# Altium project PowerSupply_v2-5.PrjPcb
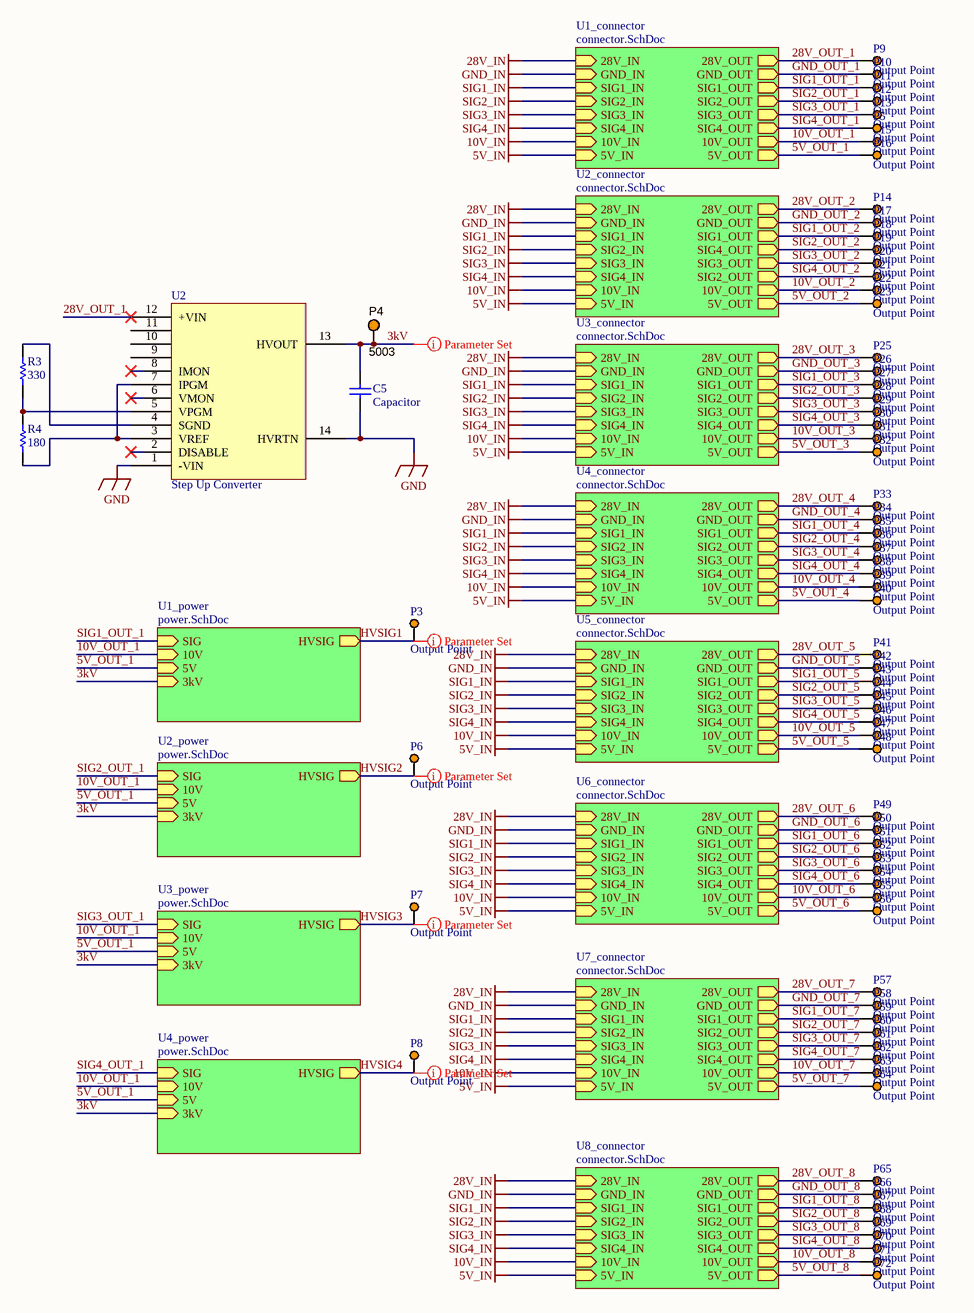
[diagram p0: top.SchDoc]
3 sheets, 121 parts. Net scope: hierarchical (ports join the sheet entries above them; power ports are global).
Board file: board.PcbDoc
Sheets:
  top.SchDoc
    U1_power = power.SchDoc
    U2_power = power.SchDoc
    U3_power = power.SchDoc
    U4_power = power.SchDoc
    U5_connector = connector.SchDoc
    U6_connector = connector.SchDoc
    U7_connector = connector.SchDoc
    U8_connector = connector.SchDoc
    U1_connector = connector.SchDoc
    U2_connector = connector.SchDoc
    U3_connector = connector.SchDoc
    U4_connector = connector.SchDoc

## Sheet top.SchDoc
size C; SheetNumber: 1; SheetTotal: 3

### Parts
C5  Capacitor  [HV Capacitor]
P3  Output Point  [Via]
P4  5003  [KSTN-5003]
P5  Output Point  [Via]
P6  Output Point  [Via]
P7  Output Point  [Via]
P8  Output Point  [Via]
P9  Output Point  [Via]
P10  Output Point  [Via]
P11  Output Point  [Via]
P12  Output Point  [Via]
P13  Output Point  [Via]
P14  Output Point  [Via]
P15  Output Point  [Via]
P16  Output Point  [Via]
P17  Output Point  [Via]
P18  Output Point  [Via]
P19  Output Point  [Via]
P20  Output Point  [Via]
P21  Output Point  [Via]
P22  Output Point  [Via]
P23  Output Point  [Via]
P25  Output Point  [Via]
P26  Output Point  [Via]
P27  Output Point  [Via]
P28  Output Point  [Via]
P29  Output Point  [Via]
P30  Output Point  [Via]
P31  Output Point  [Via]
P32  Output Point  [Via]
P33  Output Point  [Via]
P34  Output Point  [Via]
P35  Output Point  [Via]
P36  Output Point  [Via]
P37  Output Point  [Via]
P38  Output Point  [Via]
P39  Output Point  [Via]
P40  Output Point  [Via]
P41  Output Point  [Via]
P42  Output Point  [Via]
P43  Output Point  [Via]
P44  Output Point  [Via]
P45  Output Point  [Via]
P46  Output Point  [Via]
P47  Output Point  [Via]
P48  Output Point  [Via]
P49  Output Point  [Via]
P50  Output Point  [Via]
P51  Output Point  [Via]
P52  Output Point  [Via]
P53  Output Point  [Via]
P54  Output Point  [Via]
P55  Output Point  [Via]
P56  Output Point  [Via]
P57  Output Point  [Via]
P58  Output Point  [Via]
P59  Output Point  [Via]
P60  Output Point  [Via]
P61  Output Point  [Via]
P62  Output Point  [Via]
P63  Output Point  [Via]
P64  Output Point  [Via]
P65  Output Point  [Via]
P66  Output Point  [Via]
P67  Output Point  [Via]
P68  Output Point  [Via]
P69  Output Point  [Via]
P70  Output Point  [Via]
P71  Output Point  [Via]
P72  Output Point  [Via]
R3  330  [4.99 Ohm]
R4  180  [4.99 Ohm]
U2  Step Up Converter  [Step Up Converter]

### Sub-sheets
U1_connector = connector.SchDoc: 28V_IN (in), GND_IN (in), SIG1_IN (in), SIG2_IN (in), SIG3_IN (in), SIG4_IN (in), 10V_IN (in), 5V_IN (in), 28V_OUT (out), GND_OUT (out), SIG1_OUT (out), SIG2_OUT (out), SIG3_OUT (out), SIG4_OUT (out), 10V_OUT (out), 5V_OUT (out)
U1_power = power.SchDoc: SIG (in), 10V (in), 5V (in), HVSIG (out), 3kV (in)
U2_connector = connector.SchDoc: 28V_IN (in), GND_IN (in), SIG1_IN (in), SIG2_IN (in), SIG3_IN (in), SIG4_IN (in), 10V_IN (in), 5V_IN (in), 28V_OUT (out), GND_OUT (out), SIG1_OUT (out), SIG4_OUT (out), SIG3_OUT (out), SIG2_OUT (out), 10V_OUT (out), 5V_OUT (out)
U2_power = power.SchDoc: SIG (in), 10V (in), 5V (in), HVSIG (out), 3kV (in)
U3_connector = connector.SchDoc: 28V_IN (in), GND_IN (in), SIG1_IN (in), SIG2_IN (in), SIG3_IN (in), SIG4_IN (in), 10V_IN (in), 5V_IN (in), 28V_OUT (out), GND_OUT (out), SIG1_OUT (out), SIG2_OUT (out), SIG3_OUT (out), SIG4_OUT (out), 10V_OUT (out), 5V_OUT (out)
U3_power = power.SchDoc: SIG (in), 10V (in), 5V (in), HVSIG (out), 3kV (in)
U4_connector = connector.SchDoc: 28V_IN (in), GND_IN (in), SIG1_IN (in), SIG2_IN (in), SIG3_IN (in), SIG4_IN (in), 10V_IN (in), 5V_IN (in), 28V_OUT (out), GND_OUT (out), SIG1_OUT (out), SIG2_OUT (out), SIG3_OUT (out), SIG4_OUT (out), 10V_OUT (out), 5V_OUT (out)
U4_power = power.SchDoc: SIG (in), 10V (in), 5V (in), HVSIG (out), 3kV (in)
U5_connector = connector.SchDoc: 28V_IN (in), GND_IN (in), SIG1_IN (in), SIG2_IN (in), SIG3_IN (in), SIG4_IN (in), 10V_IN (in), 5V_IN (in), 28V_OUT (out), GND_OUT (out), SIG1_OUT (out), SIG2_OUT (out), SIG3_OUT (out), SIG4_OUT (out), 10V_OUT (out), 5V_OUT (out)
U6_connector = connector.SchDoc: 28V_IN (in), GND_IN (in), SIG1_IN (in), SIG2_IN (in), SIG3_IN (in), SIG4_IN (in), 10V_IN (in), 5V_IN (in), 28V_OUT (out), GND_OUT (out), SIG1_OUT (out), SIG2_OUT (out), SIG3_OUT (out), SIG4_OUT (out), 10V_OUT (out), 5V_OUT (out)
U7_connector = connector.SchDoc: 28V_IN (in), GND_IN (in), SIG1_IN (in), SIG2_IN (in), SIG3_IN (in), SIG4_IN (in), 10V_IN (in), 5V_IN (in), 28V_OUT (out), GND_OUT (out), SIG1_OUT (out), SIG2_OUT (out), SIG3_OUT (out), SIG4_OUT (out), 10V_OUT (out), 5V_OUT (out)
U8_connector = connector.SchDoc: 28V_IN (in), GND_IN (in), SIG1_IN (in), SIG2_IN (in), SIG3_IN (in), SIG4_IN (in), 10V_IN (in), 5V_IN (in), 28V_OUT (out), GND_OUT (out), SIG1_OUT (out), SIG2_OUT (out), SIG3_OUT (out), SIG4_OUT (out), 10V_OUT (out), 5V_OUT (out)

### Nets
5V_OUT_1: P16.1 P23.1 P32.1 P40.1 P48.1 P56.1 P64.1 P72.1 ; sheet U1_power/5V, sheet U2_power/5V, sheet U3_power/5V, sheet U4_power/5V, sheet U5_connector/5V_IN, sheet U5_connector/5V_OUT, sheet U6_connector/5V_IN, sheet U6_connector/5V_OUT, sheet U7_connector/5V_IN, sheet U7_connector/5V_OUT, sheet U8_connector/5V_IN, sheet U8_connector/5V_OUT, sheet U1_connector/5V_IN, sheet U1_connector/5V_OUT, sheet U2_connector/5V_IN, sheet U2_connector/5V_OUT, sheet U3_connector/5V_IN, sheet U3_connector/5V_OUT, sheet U4_connector/5V_IN, sheet U4_connector/5V_OUT  [also labelled 5V_IN, 5V_OUT_2, 5V_OUT_3, 5V_OUT_4, 5V_OUT_5, 5V_OUT_6, 5V_OUT_7, 5V_OUT_8]
10V_OUT_1: P15.1 P22.1 P31.1 P39.1 P47.1 P55.1 P63.1 P71.1 ; sheet U1_power/10V, sheet U2_power/10V, sheet U3_power/10V, sheet U4_power/10V, sheet U5_connector/10V_IN, sheet U5_connector/10V_OUT, sheet U6_connector/10V_IN, sheet U6_connector/10V_OUT, sheet U7_connector/10V_IN, sheet U7_connector/10V_OUT, sheet U8_connector/10V_IN, sheet U8_connector/10V_OUT, sheet U1_connector/10V_IN, sheet U1_connector/10V_OUT, sheet U2_connector/10V_IN, sheet U2_connector/10V_OUT, sheet U3_connector/10V_IN, sheet U3_connector/10V_OUT, sheet U4_connector/10V_IN, sheet U4_connector/10V_OUT  [also labelled 10V_IN, 10V_OUT_2, 10V_OUT_3, 10V_OUT_4, 10V_OUT_5, 10V_OUT_6, 10V_OUT_7, 10V_OUT_8]
28V_OUT_1: P9.1 P14.1 P25.1 P33.1 P41.1 P49.1 P57.1 P65.1 U2.12(+VIN) ; sheet U5_connector/28V_IN, sheet U5_connector/28V_OUT, sheet U6_connector/28V_IN, sheet U6_connector/28V_OUT, sheet U7_connector/28V_IN, sheet U7_connector/28V_OUT, sheet U8_connector/28V_IN, sheet U8_connector/28V_OUT, sheet U1_connector/28V_IN, sheet U1_connector/28V_OUT, sheet U2_connector/28V_IN, sheet U2_connector/28V_OUT, sheet U3_connector/28V_IN, sheet U3_connector/28V_OUT, sheet U4_connector/28V_IN, sheet U4_connector/28V_OUT  [also labelled 28V_IN, 28V_OUT_2, 28V_OUT_3, 28V_OUT_4, 28V_OUT_5, 28V_OUT_6, 28V_OUT_7, 28V_OUT_8]
GND: C5.1 U2.1(-VIN) U2.14(HVRTN)
GND_OUT_1: P10.1 P17.1 P26.1 P34.1 P42.1 P50.1 P58.1 P66.1 ; sheet U5_connector/GND_IN, sheet U5_connector/GND_OUT, sheet U6_connector/GND_IN, sheet U6_connector/GND_OUT, sheet U7_connector/GND_IN, sheet U7_connector/GND_OUT, sheet U8_connector/GND_IN, sheet U8_connector/GND_OUT, sheet U1_connector/GND_IN, sheet U1_connector/GND_OUT, sheet U2_connector/GND_IN, sheet U2_connector/GND_OUT, sheet U3_connector/GND_IN, sheet U3_connector/GND_OUT, sheet U4_connector/GND_IN, sheet U4_connector/GND_OUT  [also labelled GND_IN, GND_OUT_2, GND_OUT_3, GND_OUT_4, GND_OUT_5, GND_OUT_6, GND_OUT_7, GND_OUT_8]
SIG1_OUT_1: P11.1 P18.1 P27.1 P35.1 P43.1 P51.1 P59.1 P67.1 ; sheet U1_power/SIG, sheet U5_connector/SIG1_IN, sheet U5_connector/SIG1_OUT, sheet U6_connector/SIG1_IN, sheet U6_connector/SIG1_OUT, sheet U7_connector/SIG1_IN, sheet U7_connector/SIG1_OUT, sheet U8_connector/SIG1_IN, sheet U8_connector/SIG1_OUT, sheet U1_connector/SIG1_IN, sheet U1_connector/SIG1_OUT, sheet U2_connector/SIG1_IN, sheet U2_connector/SIG1_OUT, sheet U3_connector/SIG1_IN, sheet U3_connector/SIG1_OUT, sheet U4_connector/SIG1_IN, sheet U4_connector/SIG1_OUT  [also labelled SIG1_IN, SIG1_OUT_2, SIG1_OUT_3, SIG1_OUT_4, SIG1_OUT_5, SIG1_OUT_6, SIG1_OUT_7, SIG1_OUT_8]
SIG2_OUT_1: P12.1 P21.1 P28.1 P36.1 P44.1 P52.1 P60.1 P68.1 ; sheet U2_power/SIG, sheet U5_connector/SIG2_IN, sheet U5_connector/SIG2_OUT, sheet U6_connector/SIG2_IN, sheet U6_connector/SIG2_OUT, sheet U7_connector/SIG2_IN, sheet U7_connector/SIG2_OUT, sheet U8_connector/SIG2_IN, sheet U8_connector/SIG2_OUT, sheet U1_connector/SIG2_IN, sheet U1_connector/SIG2_OUT, sheet U2_connector/SIG2_IN, sheet U2_connector/SIG2_OUT, sheet U3_connector/SIG2_IN, sheet U3_connector/SIG2_OUT, sheet U4_connector/SIG2_IN, sheet U4_connector/SIG2_OUT  [also labelled SIG2_IN, SIG2_OUT_3, SIG2_OUT_4, SIG2_OUT_5, SIG2_OUT_6, SIG2_OUT_7, SIG2_OUT_8, SIG4_OUT_2]
SIG2_OUT_2: P5.1 P19.1 P30.1 P38.1 P46.1 P54.1 P62.1 P70.1 ; sheet U4_power/SIG, sheet U5_connector/SIG4_IN, sheet U5_connector/SIG4_OUT, sheet U6_connector/SIG4_IN, sheet U6_connector/SIG4_OUT, sheet U7_connector/SIG4_IN, sheet U7_connector/SIG4_OUT, sheet U8_connector/SIG4_IN, sheet U8_connector/SIG4_OUT, sheet U1_connector/SIG4_IN, sheet U1_connector/SIG4_OUT, sheet U2_connector/SIG4_IN, sheet U2_connector/SIG4_OUT, sheet U3_connector/SIG4_IN, sheet U3_connector/SIG4_OUT, sheet U4_connector/SIG4_IN, sheet U4_connector/SIG4_OUT  [also labelled SIG4_IN, SIG4_OUT_1, SIG4_OUT_3, SIG4_OUT_4, SIG4_OUT_5, SIG4_OUT_6, SIG4_OUT_7, SIG4_OUT_8]
SIG3_OUT_1: P13.1 P20.1 P29.1 P37.1 P45.1 P53.1 P61.1 P69.1 ; sheet U3_power/SIG, sheet U5_connector/SIG3_IN, sheet U5_connector/SIG3_OUT, sheet U6_connector/SIG3_IN, sheet U6_connector/SIG3_OUT, sheet U7_connector/SIG3_IN, sheet U7_connector/SIG3_OUT, sheet U8_connector/SIG3_IN, sheet U8_connector/SIG3_OUT, sheet U1_connector/SIG3_IN, sheet U1_connector/SIG3_OUT, sheet U2_connector/SIG3_IN, sheet U2_connector/SIG3_OUT, sheet U3_connector/SIG3_IN, sheet U3_connector/SIG3_OUT, sheet U4_connector/SIG3_IN, sheet U4_connector/SIG3_OUT  [also labelled SIG3_IN, SIG3_OUT_2, SIG3_OUT_3, SIG3_OUT_4, SIG3_OUT_5, SIG3_OUT_6, SIG3_OUT_7, SIG3_OUT_8]
3kV: C5.2 P4.1 U2.13(HVOUT) ; sheet U1_power/3kV, sheet U2_power/3kV, sheet U3_power/3kV, sheet U4_power/3kV
HVSIG1: P3.1 ; sheet U1_power/HVSIG
HVSIG2: P6.1 ; sheet U2_power/HVSIG
HVSIG3: P7.1 ; sheet U3_power/HVSIG
HVSIG4: P8.1 ; sheet U4_power/HVSIG
NetR3_1: R3.1 U2.4(SGND)
NetR3_2: R3.2 R4.1 U2.5(VPGM)
NetR4_2: R4.2 U2.3(VREF) U2.7(IPGM)

Not connected (* = marked no-connect by the designer): U2 2(DISABLE)* 6(VMON)* 8(IMON)* 9 10 11

### Layout directives
rule Clearance Constraint [Generic clearance = 5mm, and 18 value(s) for objects]: 3kV, HVSIG1, HVSIG2, HVSIG3, HVSIG4

### Library data of the parts
P3 P5-P23 P25-P72 = Output Point: Thru hole via
P4 = CMP-002-00037-2: Test Point, Orange, Height 4.6 mm, Tail Length 3 mm, 1-Pin THD, RoHS; Manufacturer: Keystone; Colour: Orange; Packaging: Bulk; Package Description: 1-Pin Through Hole Device, Dia 2.54 mm; Pins: 1; Package Reference: 5003; Datasheet Version: Jun-15; Case/Package: 5003; Mounting Technology: TH; Connector Type: TestPoint; Diameter: 2.54mm; Contact Material: Bronze; Datasheet URL: http://keyelco.com/userAssets/file/M65p56.pdf; Manufacturer URL: http://www.keyelco.com/; Package Quantity: 10; Contact Plating: Tin; RoHS Compliant: True
R3 R4 = Resistor
U2 = Step Up Converter: HRL30

## Sheet power.SchDoc
size A; SheetNumber: 2; SheetTotal: 3
Used 4 times, as channels U1_power, U2_power, U3_power, U4_power. Parts and nets are listed once, with the designators drawn on the sheet.
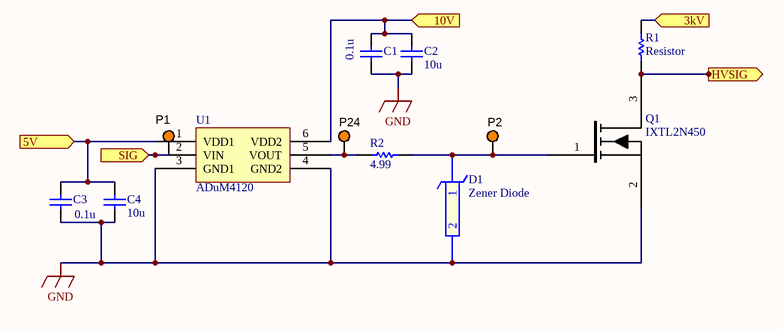
[diagram p1: power.SchDoc]

### Parts
C1  Capacitor  [0.1uF Cer SMD]  (value not drawn)
C2  10u  [10uF Cer SMD]
C3  Capacitor  [0.1uF Cer SMD]  (value not drawn)
C4  10u  [10uF Cer SMD]
D1  Zener Diode  [Zener Diode]
P1  5003  [KSTN-5003]  (value not drawn)
P2  5003  [KSTN-5003]  (value not drawn)
P24  5003  [KSTN-5003]  (value not drawn)
Q1  IXTL2N450  [MOSFET]
R1  Resistor  [4.99 Ohm]
R2  4.99  [4.99 Ohm]
U1  ADuM4120  [Gate Driver]

### Ports
3kV (in), 5V (in), 10V (in), HVSIG (out), SIG (in)

### Nets
GND: C1.1 C2.1 C3.1 C4.1 D1.2 Q1.2(S) U1.3(GND1) U1.4(GND2)
3kV: R1.1 ; port 3kV
5V: C3.2 C4.2 U1.1(VDD1) ; port 5V
10V: C1.2 C2.2 U1.6(VDD2) ; port 10V
HVSIG: Q1.3(D) R1.2 ; port HVSIG
SIG: P1.1 U1.2(VIN) ; port SIG
NetD1_1: D1.1 P2.1 Q1.1(G) R2.1
NetP24_1: P24.1 R2.2 U1.5(VOUT)

### Channels
U1_power: designators end in _1; ports 3kV=3kV 5V=5V_OUT_1 10V=10V_OUT_1 HVSIG=HVSIG1 SIG=SIG1_OUT_1
U2_power: designators end in _2; ports 3kV=3kV 5V=5V_OUT_1 10V=10V_OUT_1 HVSIG=HVSIG2 SIG=SIG2_OUT_1
U3_power: designators end in _3; ports 3kV=3kV 5V=5V_OUT_1 10V=10V_OUT_1 HVSIG=HVSIG3 SIG=SIG3_OUT_1
U4_power: designators end in _4; ports 3kV=3kV 5V=5V_OUT_1 10V=10V_OUT_1 HVSIG=HVSIG4 SIG=SIG2_OUT_2

### Notes on the sheet
- (near C1) 0.1u
- 0.1u

### Library data of the parts
C2 C4 = Capacitor
D1 = Zener Diode: KDZVTR16B; Vendor: ROHM Semiconductor; Built_By: EMA_Matt; SourceLibrary: Rohm_2019-09-23; Type: DEV; Manufacturer_Part_Number: KDZVTR16B; Copyright: Copyright (C) 2018 Accelerated Designs. All rights reserved; RefDes: RefDes
P1 P2 P24 = CMP-002-00037-2: as P4 on sheet top; Colour: Orange; Packaging: Bulk; Package Description: 1-Pin Through Hole Device, Dia 2.54 mm; Pins: 1; Package Reference: 5003; Datasheet Version: Jun-15; Case/Package: 5003; Mounting Technology: TH; Connector Type: TestPoint; Diameter: 2.54mm; Contact Material: Bronze; Datasheet URL: http://keyelco.com/userAssets/file/M65p56.pdf; Manufacturer URL: http://www.keyelco.com/; Package Quantity: 10; Contact Plating: Tin; RoHS Compliant: True
Q1 = MOSFET: IXTL2N4X0
R2 = Resistor
U1 = Gate Driver

## Sheet connector.SchDoc
size A; SheetNumber: 3; SheetTotal: 3
Used 8 times, as channels U5_connector, U6_connector, U7_connector, U8_connector, U1_connector, U2_connector, U3_connector, U4_connector. Parts and nets are listed once, with the designators drawn on the sheet.
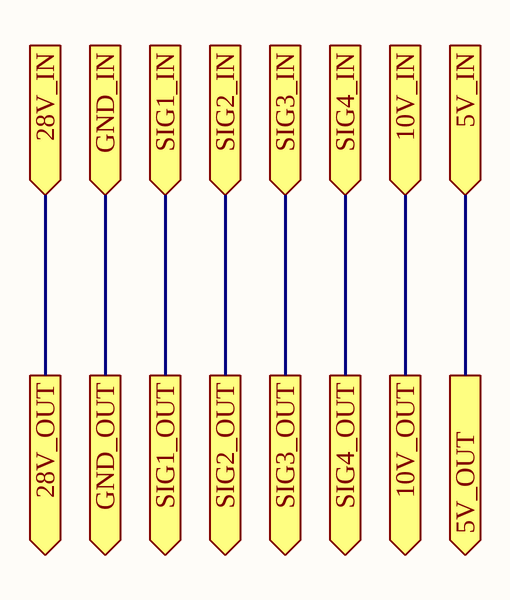
[diagram p2: connector.SchDoc]

### Ports
5V_IN (in), 5V_OUT (out), 10V_IN (in), 10V_OUT (out), 28V_IN (in), 28V_OUT (out), GND_IN (in), GND_OUT (out), SIG1_IN (in), SIG1_OUT (out), SIG2_IN (in), SIG2_OUT (out), SIG3_IN (in), SIG3_OUT (out), SIG4_IN (in), SIG4_OUT (out)

### Nets
5V_IN: port 5V_IN, port 5V_OUT
10V_IN: port 10V_IN, port 10V_OUT
28V_IN: port 28V_IN, port 28V_OUT
GND_IN: port GND_IN, port GND_OUT
SIG1_IN: port SIG1_IN, port SIG1_OUT
SIG2_IN: port SIG2_IN, port SIG2_OUT
SIG3_IN: port SIG3_IN, port SIG3_OUT
SIG4_IN: port SIG4_IN, port SIG4_OUT

### Channels
U5_connector: ports 5V_IN=5V_OUT_1 5V_OUT=5V_OUT_1 10V_IN=10V_OUT_1 10V_OUT=10V_OUT_1 28V_IN=28V_OUT_1 28V_OUT=28V_OUT_1 GND_IN=GND_OUT_1 GND_OUT=GND_OUT_1 SIG1_IN=SIG1_OUT_1 SIG1_OUT=SIG1_OUT_1 SIG2_IN=SIG2_OUT_1 SIG2_OUT=SIG2_OUT_1 SIG3_IN=SIG3_OUT_1 SIG3_OUT=SIG3_OUT_1 SIG4_IN=SIG2_OUT_2 SIG4_OUT=SIG2_OUT_2
U6_connector: ports 5V_IN=5V_OUT_1 5V_OUT=5V_OUT_1 10V_IN=10V_OUT_1 10V_OUT=10V_OUT_1 28V_IN=28V_OUT_1 28V_OUT=28V_OUT_1 GND_IN=GND_OUT_1 GND_OUT=GND_OUT_1 SIG1_IN=SIG1_OUT_1 SIG1_OUT=SIG1_OUT_1 SIG2_IN=SIG2_OUT_1 SIG2_OUT=SIG2_OUT_1 SIG3_IN=SIG3_OUT_1 SIG3_OUT=SIG3_OUT_1 SIG4_IN=SIG2_OUT_2 SIG4_OUT=SIG2_OUT_2
U7_connector: ports 5V_IN=5V_OUT_1 5V_OUT=5V_OUT_1 10V_IN=10V_OUT_1 10V_OUT=10V_OUT_1 28V_IN=28V_OUT_1 28V_OUT=28V_OUT_1 GND_IN=GND_OUT_1 GND_OUT=GND_OUT_1 SIG1_IN=SIG1_OUT_1 SIG1_OUT=SIG1_OUT_1 SIG2_IN=SIG2_OUT_1 SIG2_OUT=SIG2_OUT_1 SIG3_IN=SIG3_OUT_1 SIG3_OUT=SIG3_OUT_1 SIG4_IN=SIG2_OUT_2 SIG4_OUT=SIG2_OUT_2
U8_connector: ports 5V_IN=5V_OUT_1 5V_OUT=5V_OUT_1 10V_IN=10V_OUT_1 10V_OUT=10V_OUT_1 28V_IN=28V_OUT_1 28V_OUT=28V_OUT_1 GND_IN=GND_OUT_1 GND_OUT=GND_OUT_1 SIG1_IN=SIG1_OUT_1 SIG1_OUT=SIG1_OUT_1 SIG2_IN=SIG2_OUT_1 SIG2_OUT=SIG2_OUT_1 SIG3_IN=SIG3_OUT_1 SIG3_OUT=SIG3_OUT_1 SIG4_IN=SIG2_OUT_2 SIG4_OUT=SIG2_OUT_2
U1_connector: ports 5V_IN=5V_OUT_1 5V_OUT=5V_OUT_1 10V_IN=10V_OUT_1 10V_OUT=10V_OUT_1 28V_IN=28V_OUT_1 28V_OUT=28V_OUT_1 GND_IN=GND_OUT_1 GND_OUT=GND_OUT_1 SIG1_IN=SIG1_OUT_1 SIG1_OUT=SIG1_OUT_1 SIG2_IN=SIG2_OUT_1 SIG2_OUT=SIG2_OUT_1 SIG3_IN=SIG3_OUT_1 SIG3_OUT=SIG3_OUT_1 SIG4_IN=SIG2_OUT_2 SIG4_OUT=SIG2_OUT_2
U2_connector: ports 5V_IN=5V_OUT_1 5V_OUT=5V_OUT_1 10V_IN=10V_OUT_1 10V_OUT=10V_OUT_1 28V_IN=28V_OUT_1 28V_OUT=28V_OUT_1 GND_IN=GND_OUT_1 GND_OUT=GND_OUT_1 SIG1_IN=SIG1_OUT_1 SIG1_OUT=SIG1_OUT_1 SIG2_IN=SIG2_OUT_1 SIG2_OUT=SIG2_OUT_1 SIG3_IN=SIG3_OUT_1 SIG3_OUT=SIG3_OUT_1 SIG4_IN=SIG2_OUT_2 SIG4_OUT=SIG2_OUT_2
U3_connector: ports 5V_IN=5V_OUT_1 5V_OUT=5V_OUT_1 10V_IN=10V_OUT_1 10V_OUT=10V_OUT_1 28V_IN=28V_OUT_1 28V_OUT=28V_OUT_1 GND_IN=GND_OUT_1 GND_OUT=GND_OUT_1 SIG1_IN=SIG1_OUT_1 SIG1_OUT=SIG1_OUT_1 SIG2_IN=SIG2_OUT_1 SIG2_OUT=SIG2_OUT_1 SIG3_IN=SIG3_OUT_1 SIG3_OUT=SIG3_OUT_1 SIG4_IN=SIG2_OUT_2 SIG4_OUT=SIG2_OUT_2
U4_connector: ports 5V_IN=5V_OUT_1 5V_OUT=5V_OUT_1 10V_IN=10V_OUT_1 10V_OUT=10V_OUT_1 28V_IN=28V_OUT_1 28V_OUT=28V_OUT_1 GND_IN=GND_OUT_1 GND_OUT=GND_OUT_1 SIG1_IN=SIG1_OUT_1 SIG1_OUT=SIG1_OUT_1 SIG2_IN=SIG2_OUT_1 SIG2_OUT=SIG2_OUT_1 SIG3_IN=SIG3_OUT_1 SIG3_OUT=SIG3_OUT_1 SIG4_IN=SIG2_OUT_2 SIG4_OUT=SIG2_OUT_2

## Nets that join several sheets
5V_OUT_1: top (8 pins), U1_power (C3_1.2 C4_1.2 U1_1.1), U2_power (C3_2.2 C4_2.2 U1_2.1), U3_power (C3_3.2 C4_3.2 U1_3.1), U4_power (C3_4.2 C4_4.2 U1_4.1)
10V_OUT_1: top (8 pins), U1_power (C1_1.2 C2_1.2 U1_1.6), U2_power (C1_2.2 C2_2.2 U1_2.6), U3_power (C1_3.2 C2_3.2 U1_3.6), U4_power (C1_4.2 C2_4.2 U1_4.6)
GND: top (C5.1 U2.1 U2.14), U1_power (8 pins), U2_power (8 pins), U3_power (8 pins), U4_power (8 pins)
SIG1_OUT_1: top (8 pins), U1_power (P1_1.1 U1_1.2)
SIG2_OUT_1: top (8 pins), U2_power (P1_2.1 U1_2.2)
SIG2_OUT_2: top (8 pins), U4_power (P1_4.1 U1_4.2)
SIG3_OUT_1: top (8 pins), U3_power (P1_3.1 U1_3.2)
3kV: top (C5.2 P4.1 U2.13), U1_power (R1_1.1), U2_power (R1_2.1), U3_power (R1_3.1), U4_power (R1_4.1)
HVSIG1: top (P3.1), U1_power (Q1_1.3 R1_1.2)
HVSIG2: top (P6.1), U2_power (Q1_2.3 R1_2.2)
HVSIG3: top (P7.1), U3_power (Q1_3.3 R1_3.2)
HVSIG4: top (P8.1), U4_power (Q1_4.3 R1_4.2)